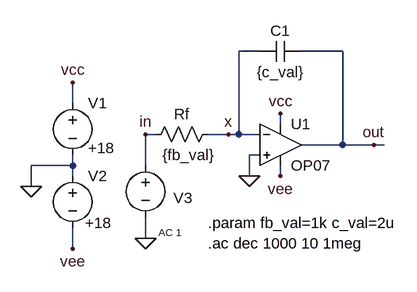
[diagram p0: schematic 14-integrator_bode.asc]
14-integrator_bode.asc, the LTspice schematic file:
Version 4
SHEET 1 880 680
WIRE 160 -64 128 -64
WIRE 288 -64 224 -64
WIRE -128 16 -128 -16
WIRE 192 48 192 32
WIRE 0 64 -16 64
WIRE 112 64 80 64
WIRE 128 64 128 -64
WIRE 128 64 112 64
WIRE 160 64 128 64
WIRE 288 80 288 -64
WIRE 288 80 224 80
WIRE 336 80 288 80
WIRE 352 80 336 80
WIRE 160 96 144 96
WIRE -128 112 -128 96
WIRE -128 112 -192 112
WIRE -16 112 -16 64
WIRE -128 128 -128 112
WIRE 144 128 144 96
WIRE 192 128 192 112
WIRE -192 144 -192 112
WIRE -16 224 -16 192
WIRE -128 240 -128 208
FLAG -192 144 0
FLAG -128 -16 vcc
FLAG -128 240 vee
FLAG -16 224 0
FLAG -16 64 in
FLAG 192 128 vee
FLAG 192 32 vcc
FLAG 336 80 out
FLAG 144 128 0
FLAG 112 64 x
SYMBOL OpAmps\\OP07 192 16 R0
SYMATTR InstName U1
SYMBOL voltage -128 0 R0
WINDOW 3 24 85 Left 2
WINDOW 123 0 0 Left 0
WINDOW 39 0 0 Left 0
SYMATTR Value +18
SYMATTR InstName V1
SYMBOL voltage -128 112 R0
WINDOW 3 19 88 Left 2
WINDOW 123 0 0 Left 0
WINDOW 39 0 0 Left 0
SYMATTR Value +18
SYMATTR InstName V2
SYMBOL voltage -16 96 R0
WINDOW 0 43 66 Left 2
WINDOW 3 20 91 Left 1
WINDOW 123 20 119 Left 1
WINDOW 39 0 0 Left 0
SYMATTR InstName V3
SYMATTR Value ""
SYMATTR Value2 AC 1
SYMBOL res 96 48 R90
WINDOW 0 0 56 VBottom 2
WINDOW 3 32 45 VTop 2
SYMATTR InstName Rf
SYMATTR Value {fb_val}
SYMBOL cap 224 -80 R90
WINDOW 0 0 32 VBottom 2
WINDOW 3 32 32 VTop 2
SYMATTR InstName C1
SYMATTR Value {c_val}
TEXT 80 200 Left 2 !.param fb_val=1k c_val=2u
TEXT 80 232 Left 2 !.ac dec 1000 10 1meg

The netlist it stands for:
* 14-integrator_bode.asc
XU1 0 x vcc vee out LT1001  ; OP07, pins In+ In- V+ V- OUT
V1 vcc 0 +18
V2 0 vee +18
V3 in 0 AC 1
Rf x in {fb_val}
C1 out x {c_val}
.param fb_val=1k c_val=2u
.ac dec 1000 10 1meg
.lib LTC.lib
.backanno
.end

* Results of the author's LTspice run, read from the files saved beside the schematic
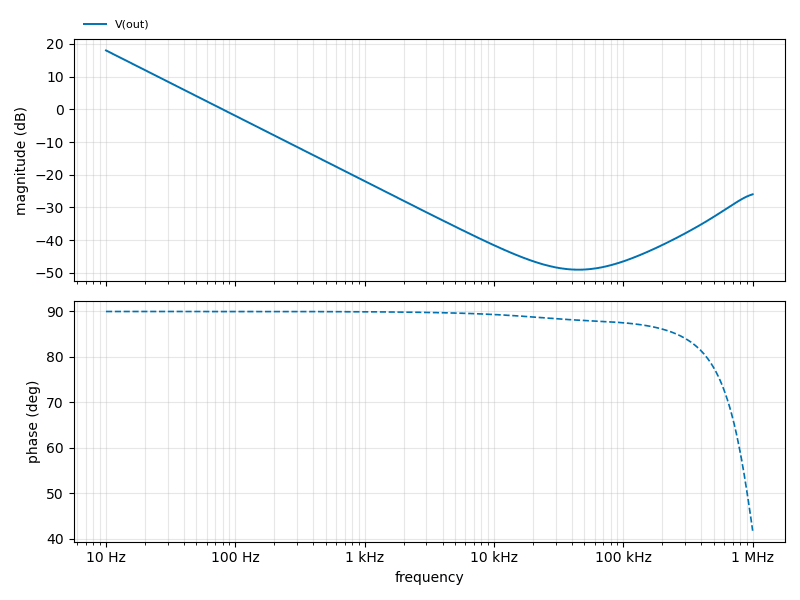
[diagram p1: AC Analysis of 14-integrator_bode.asc, plotted from the saved traces]
* AC Analysis, 1 run:
*   V(out): 18.01 dB at 10 Hz, -25.99 dB at 1 MHz, peak 18.01 dB at 10 Hz, 3 dB below the peak at 14.14 Hz